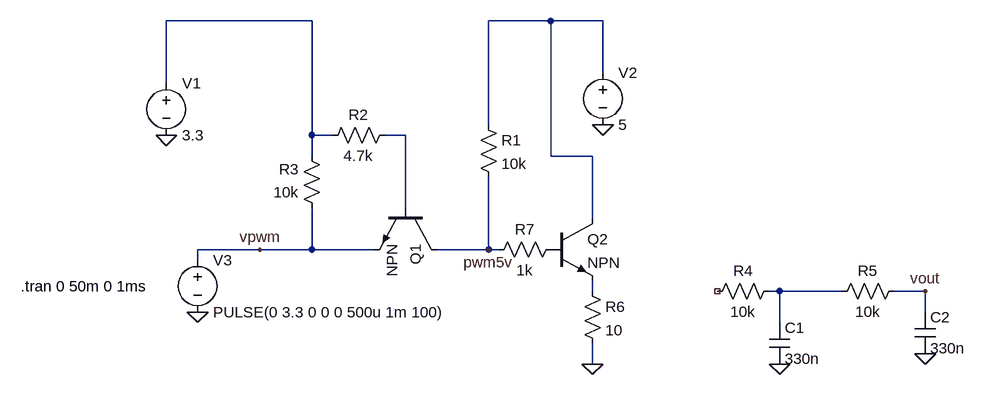
[diagram p0: schematic convertidor3_3_to_5.asc]
convertidor3_3_to_5.asc, the LTspice schematic file:
Version 4
SHEET 1 1016 680
WIRE 0 -112 -224 -112
WIRE 368 -112 272 -112
WIRE 448 -112 368 -112
WIRE 448 -32 448 -112
WIRE -224 -16 -224 -112
WIRE 272 48 272 -112
WIRE 0 64 0 -112
WIRE 32 64 0 64
WIRE 144 64 112 64
WIRE 0 96 0 64
WIRE 368 96 368 -112
WIRE 432 96 368 96
WIRE 144 176 144 64
WIRE 432 192 432 96
WIRE -80 240 -176 240
WIRE 0 240 0 176
WIRE 0 240 -80 240
WIRE 96 240 0 240
WIRE 272 240 272 128
WIRE 272 240 192 240
WIRE 288 240 272 240
WIRE -176 256 -176 240
WIRE 432 304 432 288
WIRE 720 304 704 304
WIRE 816 304 720 304
WIRE 944 304 896 304
WIRE 944 336 944 304
WIRE 720 352 720 304
WIRE 432 416 432 384
FLAG -224 64 0
FLAG 448 48 0
FLAG -176 336 0
FLAG 720 416 0
FLAG 944 304 vout
FLAG -80 240 vpwm
FLAG 944 400 0
FLAG 272 240 pwm5v
FLAG 432 416 0
SYMBOL res 256 32 R0
SYMATTR InstName R1
SYMATTR Value 10k
SYMBOL res 128 48 R90
WINDOW 0 0 56 VBottom 2
WINDOW 3 32 56 VTop 2
SYMATTR InstName R2
SYMATTR Value 4.7k
SYMBOL res 16 192 R180
WINDOW 0 36 76 Left 2
WINDOW 3 36 40 Left 2
SYMATTR InstName R3
SYMATTR Value 10k
SYMBOL npn 192 176 R90
SYMATTR InstName Q1
SYMBOL voltage -224 -32 R0
WINDOW 123 0 0 Left 0
WINDOW 39 0 0 Left 0
SYMATTR InstName V1
SYMATTR Value 3.3
SYMBOL voltage 448 -48 R0
WINDOW 123 0 0 Left 0
WINDOW 39 0 0 Left 0
SYMATTR InstName V2
SYMATTR Value 5
SYMBOL voltage -176 240 R0
WINDOW 123 0 0 Left 0
WINDOW 39 0 0 Left 0
SYMATTR InstName V3
SYMATTR Value PULSE(0 3.3 0 0 0 500u 1m 100)
SYMBOL res 720 288 R90
WINDOW 0 0 56 VBottom 2
WINDOW 3 32 56 VTop 2
SYMATTR InstName R4
SYMATTR Value 10k
SYMBOL cap 704 352 R0
SYMATTR InstName C1
SYMATTR Value 330n
SYMBOL res 912 288 R90
WINDOW 0 0 56 VBottom 2
WINDOW 3 32 56 VTop 2
SYMATTR InstName R5
SYMATTR Value 10k
SYMBOL cap 928 336 R0
SYMATTR InstName C2
SYMATTR Value 330n
SYMBOL npn 368 192 R0
SYMATTR InstName Q2
SYMBOL res 416 288 R0
SYMATTR InstName R6
SYMATTR Value 10
SYMBOL res 384 224 R90
WINDOW 0 0 56 VBottom 2
WINDOW 3 32 56 VTop 2
SYMATTR InstName R7
SYMATTR Value 1k
TEXT -448 296 Left 2 !.tran 0 50m 0 1ms

The netlist it stands for:
* convertidor3_3_to_5.asc
R1 N002 pwm5v 10k
R2 N003 N001 4.7k
R3 vpwm N001 10k
Q1 pwm5v N003 vpwm 0 NPN
V1 N001 0 3.3
V2 N002 0 5
V3 vpwm 0 PULSE(0 3.3 0 0 0 500u 1m 100)
R4 N005 NC_01 10k
C1 N005 0 330n
R5 vout N005 10k
C2 vout 0 330n
Q2 N002 P001 N004 0 NPN
R6 N004 0 10
R7 P001 pwm5v 1k
.model NPN NPN
.model PNP PNP
.lib standard.bjt
.tran 0 50m 0 1ms
.backanno
.end